# Altium project PTW_Switch_Board.PrjPcb
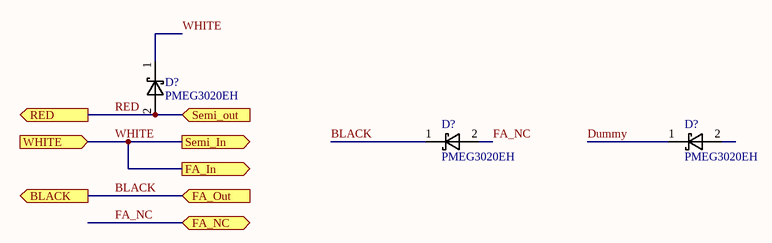
[diagram p0: Switch_Board.SchDoc]
1 sheet, 3 parts. Net scope: flat (ports and power ports of the same name join across sheets).
Board file: PTW_Switch_Board_V1.PcbDoc

## Sheet Switch_Board.SchDoc
size A4

### Parts
(Parts that share a designator on the sheet are numbered #1, #2 ... from top to bottom, then left to right.)
D?#1  PMEG3020EH  [SOD123F]
D?#2  PMEG3020EH  [SOD123F]
D?#3  PMEG3020EH  [SOD123F]

### Ports
BLACK (out), FA_In (out), FA_NC, FA_Out (in), RED (out), Semi_In (out), Semi_out (in), WHITE (in)

### Nets
BLACK: D?#2.1 ; port BLACK, port FA_Out
Dummy: D?#3.1
FA_NC: D?#2.2 ; port FA_NC
RED: D?#1.2 ; port RED, port Semi_out
WHITE: D?#1.1 ; port WHITE, port Semi_In, port FA_In

Not connected (* = marked no-connect by the designer): D?#3 2

### Library data of the parts
D?#1-D?#3 = PMEG3020EH: Diode Shottky 30V, 2A; Manufacturer: ON Semiconductor; ComponentLink1Description: Manufacturer URL; ComponentLink2Description: Datasheet; Manufacturer Part: PMEG3020EH; Current - Peak Pulse: 2A; Operating Temperature: -65°C ~ 150°C